# Altium schematic sheet LFR_IR.schdoc
size 302 x 70 mm
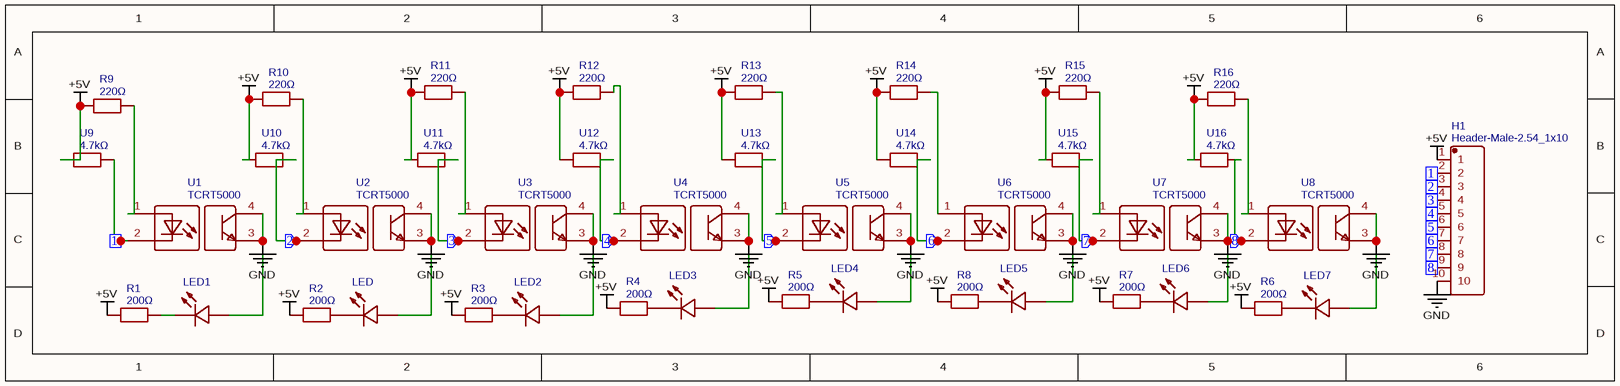
[diagram p0: LFR_IR.schdoc]

## Parts
H1  Header-Male-2.54_1x10  [HDR-TH_10P-P2.54-V-M-1]
LED  LED-2835-白  [LED-SMD_L3.5-W2.8-R-FD-WHITE]  (value not drawn)
LED1  LED-2835-白  [LED-SMD_L3.5-W2.8-R-FD-WHITE]  (value not drawn)
LED2  LED-2835-白  [LED-SMD_L3.5-W2.8-R-FD-WHITE]  (value not drawn)
LED3  LED-2835-白  [LED-SMD_L3.5-W2.8-R-FD-WHITE]  (value not drawn)
LED4  LED-2835-白  [LED-SMD_L3.5-W2.8-R-FD-WHITE]  (value not drawn)
LED5  LED-2835-白  [LED-SMD_L3.5-W2.8-R-FD-WHITE]  (value not drawn)
LED6  LED-2835-白  [LED-SMD_L3.5-W2.8-R-FD-WHITE]  (value not drawn)
LED7  LED-2835-白  [LED-SMD_L3.5-W2.8-R-FD-WHITE]  (value not drawn)
R1  200Ω  [RES-TH_BD2.7-L6.2-P10.20-D0.4]
R2  200Ω  [RES-TH_BD2.7-L6.2-P10.20-D0.4]
R3  200Ω  [RES-TH_BD2.7-L6.2-P10.20-D0.4]
R4  200Ω  [RES-TH_BD2.7-L6.2-P10.20-D0.4]
R5  200Ω  [RES-TH_BD2.7-L6.2-P10.20-D0.4]
R6  200Ω  [RES-TH_BD2.7-L6.2-P10.20-D0.4]
R7  200Ω  [RES-TH_BD2.7-L6.2-P10.20-D0.4]
R8  200Ω  [RES-TH_BD2.7-L6.2-P10.20-D0.4]
R9  220Ω  [RES-TH_BD2.7-L6.2-P10.20-D0.4]
R10  220Ω  [RES-TH_BD2.7-L6.2-P10.20-D0.4]
R11  220Ω  [RES-TH_BD2.7-L6.2-P10.20-D0.4]
R12  220Ω  [RES-TH_BD2.7-L6.2-P10.20-D0.4]
R13  220Ω  [RES-TH_BD2.7-L6.2-P10.20-D0.4]
R14  220Ω  [RES-TH_BD2.7-L6.2-P10.20-D0.4]
R15  220Ω  [RES-TH_BD2.7-L6.2-P10.20-D0.4]
R16  220Ω  [RES-TH_BD2.7-L6.2-P10.20-D0.4]
U1  TCRT5000  [OPTO-TH_TCRT5000]
U2  TCRT5000  [OPTO-TH_TCRT5000]
U3  TCRT5000  [OPTO-TH_TCRT5000]
U4  TCRT5000  [OPTO-TH_TCRT5000]
U5  TCRT5000  [OPTO-TH_TCRT5000]
U6  TCRT5000  [OPTO-TH_TCRT5000]
U7  TCRT5000  [OPTO-TH_TCRT5000]
U8  TCRT5000  [OPTO-TH_TCRT5000]
U9  4.7kΩ  [RES-TH_BD2.7-L6.2-P10.20-D0.4]
U10  4.7kΩ  [RES-TH_BD2.7-L6.2-P10.20-D0.4]
U11  4.7kΩ  [RES-TH_BD2.7-L6.2-P10.20-D0.4]
U12  4.7kΩ  [RES-TH_BD2.7-L6.2-P10.20-D0.4]
U13  4.7kΩ  [RES-TH_BD2.7-L6.2-P10.20-D0.4]
U14  4.7kΩ  [RES-TH_BD2.7-L6.2-P10.20-D0.4]
U15  4.7kΩ  [RES-TH_BD2.7-L6.2-P10.20-D0.4]
U16  4.7kΩ  [RES-TH_BD2.7-L6.2-P10.20-D0.4]

## Ports
1 (in), 2 (in), 3 (in), 4 (in), 5 (in), 6 (in), 7 (in), 8 (in)

## Nets
+5V: H1.1 R1.1 R2.1 R3.1 R4.1 R5.1 R6.1 R7.1 R8.1 R9.1 R10.1 R11.1 R12.1 R13.1 R14.1 R15.1 R16.1 U9.1 U10.1 U11.1 U12.1 U13.1 U14.1 U15.1 U16.1
GND: H1.10 LED.2(A) LED1.2(A) LED2.2(A) LED3.2(A) LED4.2(A) LED5.2(A) LED6.2(A) LED7.2(A) U1.3 U1.4 U2.3 U2.4 U3.3 U3.4 U4.3 U4.4 U5.3 U5.4 U6.3 U6.4 U7.3 U7.4 U8.3 U8.4
1: H1.2 U1.2 U9.2 ; port 1
2: H1.3 U2.2 U10.2 ; port 2
3: H1.4 U3.2 U11.2 ; port 3
4: H1.5 U4.2 U12.2 ; port 4
5: H1.6 U5.2 U13.2 ; port 5
6: H1.7 U6.2 U14.2 ; port 6
7: H1.8 U7.2 U15.2 ; port 7
8: H1.9 U8.2 U16.2 ; port 8
NetLED1_1: LED1.1(C) R1.2
NetLED2_1: LED2.1(C) R3.2
NetLED3_1: LED3.1(C) R4.2
NetLED4_1: LED4.1(C) R5.2
NetLED5_1: LED5.1(C) R8.2
NetLED6_1: LED6.1(C) R7.2
NetLED7_1: LED7.1(C) R6.2
NetLED_1: LED.1(C) R2.2
NetR9_2: R9.2 U1.1
NetR10_2: R10.2 U2.1
NetR11_2: R11.2 U3.1
NetR12_2: R12.2 U4.1
NetR13_2: R13.2 U5.1
NetR14_2: R14.2 U6.1
NetR15_2: R15.2 U7.1
NetR16_2: R16.2 U8.1

## Library data of the parts
H1 = Header-Male-2.54_1x10: Manufacturer Part: 2.54-1*10P针; Manufacturer: BOOMELE(博穆精密); Supplier: LCSC; Supplier Part: C57369; JLCPCB Part Class: Extended Part; spicePre: H; spiceSymbolName: Header-Male-2.54_1x10
LED LED1-LED7 = LED-2835-白: Manufacturer: null; Contributor: LCSC; Supplier: LCSC; Supplier Part: C9900011454; Manufacturer Part: LED-2835-白; JLCPCB Part Class: Extended Part; spicePre: L; spiceSymbolName: LED-2835-白
R1-R8 = 200Ω: Manufacturer: VO(翔胜); Manufacturer Part: CR1/4W-200Ω±5%-ST52; Contributor: lcsc; nameAlias: Value; Supplier: LCSC; Supplier Part: C2894669; JLCPCB Part Class: Extended Part; spicePre: R; spiceSymbolName: CR1/4W-200Ω±5%-ST52
R9-R16 = 220Ω: Manufacturer: VO(翔胜); Manufacturer Part: CR1/4W-220Ω±5%-ST52; Contributor: lcsc; nameAlias: Value; Supplier: LCSC; Supplier Part: C2894672; JLCPCB Part Class: Extended Part; spicePre: R; spiceSymbolName: CR1/4W-220Ω±5%-ST52
U1-U8 = TCRT5000: Manufacturer: VISHAY(威世); Contributor: lcsc; Supplier: LCSC; Supplier Part: C2984661; Manufacturer Part: TCRT5000; JLCPCB Part Class: Extended Part; spicePre: U; spiceSymbolName: TCRT5000
U9-U16 = 4.7kΩ: Manufacturer: VO(翔胜); Manufacturer Part: CR1/4W-4K7±5%-ST52; Contributor: lcsc; nameAlias: Value; Supplier: LCSC; Supplier Part: C2896834; JLCPCB Part Class: Extended Part; spicePre: U; spiceSymbolName: CR1/4W-4K7±5%-ST52